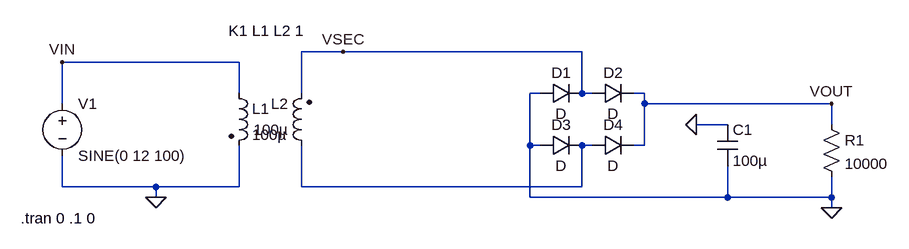
[diagram p0: schematic lab04b-Rect-full-wave.asc]
lab04b-Rect-full-wave.asc, the LTspice schematic file:
Version 4
SHEET 1 880 680
WIRE -208 16 -272 16
WIRE 160 16 -208 16
WIRE -368 32 -640 32
WIRE -368 80 -368 32
WIRE -272 80 -272 16
WIRE 96 80 80 80
WIRE 160 80 160 16
WIRE 176 80 160 80
WIRE 256 80 240 80
WIRE -640 96 -640 32
WIRE 256 96 256 80
WIRE 544 96 256 96
WIRE 384 128 336 128
WIRE 544 128 544 96
WIRE 80 160 80 80
WIRE 96 160 80 160
WIRE 176 160 160 160
WIRE 256 160 256 96
WIRE 256 160 240 160
WIRE -640 224 -640 176
WIRE -496 224 -640 224
WIRE -368 224 -368 160
WIRE -368 224 -496 224
WIRE -272 224 -272 160
WIRE 160 224 160 160
WIRE 160 224 -272 224
WIRE -496 240 -496 224
WIRE 80 240 80 160
WIRE 384 240 384 192
WIRE 384 240 80 240
WIRE 544 240 544 208
WIRE 544 240 384 240
WIRE 544 256 544 240
FLAG -640 32 VIN
FLAG 544 96 VOUT
FLAG 544 256 0
FLAG -208 16 VSEC
FLAG -496 240 0
FLAG 336 128 0
SYMBOL diode 96 96 R270
WINDOW 0 32 32 VTop 0
WINDOW 3 0 32 VBottom 0
SYMATTR InstName D1
SYMBOL diode 176 96 R270
WINDOW 0 32 32 VTop 0
WINDOW 3 0 32 VBottom 0
SYMATTR InstName D2
SYMBOL diode 96 176 R270
WINDOW 0 32 32 VTop 0
WINDOW 3 0 32 VBottom 0
SYMATTR InstName D3
SYMBOL diode 176 176 R270
WINDOW 0 32 32 VTop 0
WINDOW 3 0 32 VBottom 0
SYMATTR InstName D4
SYMBOL res 528 112 R0
SYMATTR InstName R1
SYMATTR Value 10000
SYMBOL voltage -640 80 R0
WINDOW 123 0 0 Left 0
WINDOW 39 0 0 Left 0
SYMATTR InstName V1
SYMATTR Value SINE(0 12 100)
SYMBOL cap 368 128 R0
SYMATTR InstName C1
SYMATTR Value 100µ
SYMBOL ind2 -384 64 R0
SYMATTR InstName L1
SYMATTR Value 100µ
SYMATTR Type ind
SYMATTR SpiceLine Rser=.01
SYMBOL ind2 -256 176 R180
WINDOW 0 36 80 Left 0
WINDOW 3 36 40 Left 0
SYMATTR InstName L2
SYMATTR Value 100µ
SYMATTR Type ind
SYMATTR SpiceLine Rser=.01
TEXT -704 272 Left 0 !.tran 0 .1 0
TEXT -384 -16 Left 0 !K1 L1 L2 1

The netlist it stands for:
* lab04b-Rect-full-wave.asc
D1 0 VSEC D
D2 VSEC VOUT D
D3 0 N001 D
D4 N001 VOUT D
R1 VOUT 0 10000
V1 VIN 0 SINE(0 12 100)
C1 0 0 100µ
L1 VIN 0 100µ Rser=.01
L2 N001 VSEC 100µ Rser=.01
.model D D
.lib standard.dio
.tran 0 .1 0
K1 L1 L2 1
.backanno
.end

* Results of the author's LTspice run, read from the files saved beside the schematic
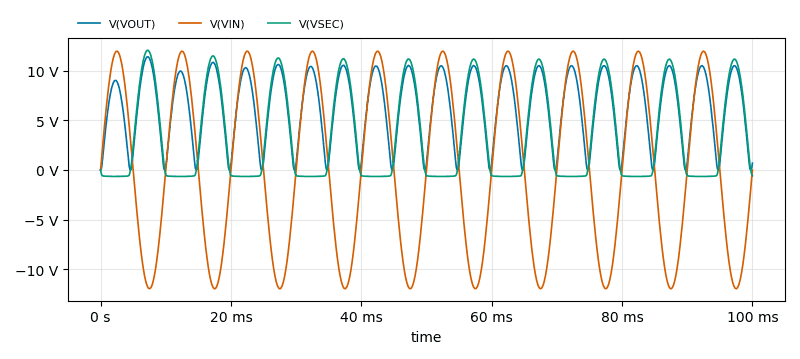
[diagram p1: Transient Analysis of lab04b-Rect-full-wave.asc, plotted from the saved traces]
* Transient Analysis, 1 run:
*   V(VOUT): min 0 V, max 11.4 V, average 6.267 V, rms 7.193 V, last 689.9 mV
*   V(VIN): min -11.99 V, max 11.99 V, average 139.9 µV, rms 8.475 V, last 0 V
*   V(VSEC): min -656.4 mV, max 12.06 V, average 3.227 V, rms 5.62 V, last -586.1 mV